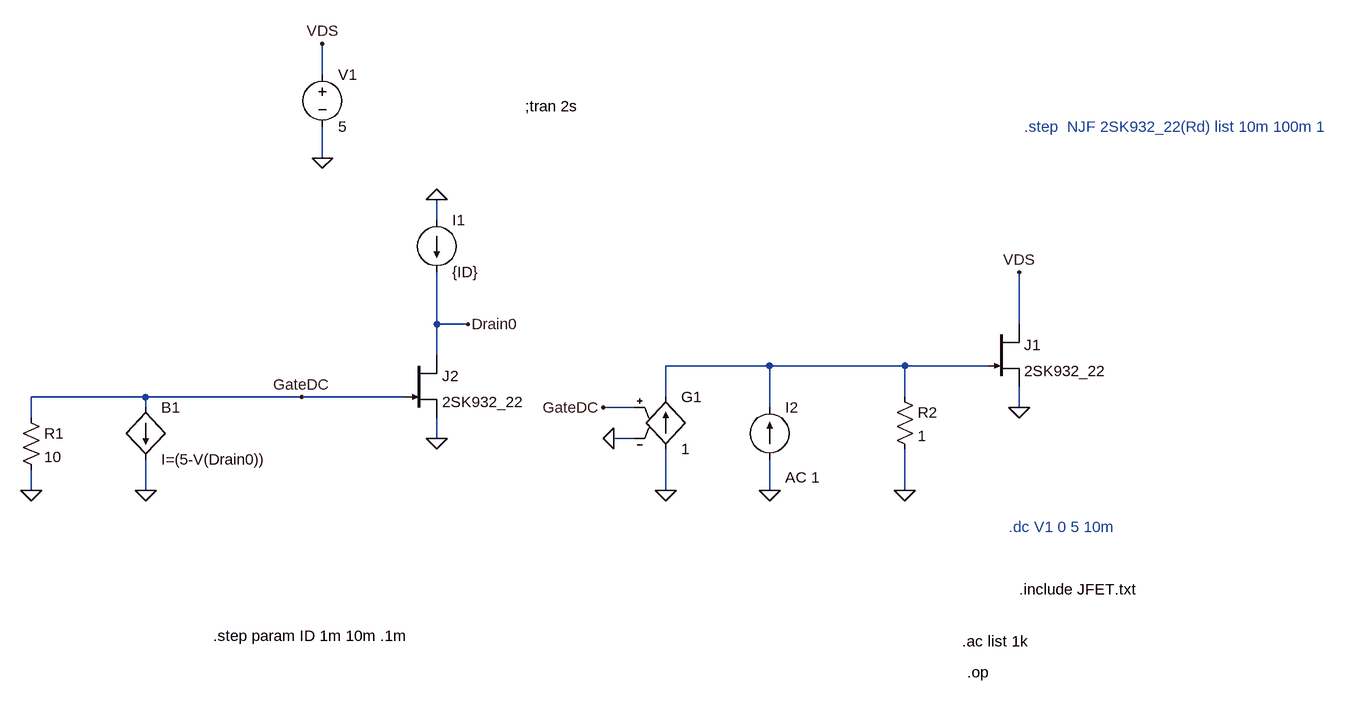
[diagram p0: schematic Yfs.asc]
Yfs.asc, the LTspice schematic file:
Version 4
SHEET 1 3232 872
WIRE -240 -176 -240 -224
WIRE -240 -48 -240 -96
WIRE -64 48 -64 16
WIRE -64 208 -64 128
WIRE -16 208 -64 208
WIRE 832 208 832 128
WIRE -64 256 -64 208
WIRE 448 272 288 272
WIRE 656 272 448 272
WIRE 784 272 656 272
WIRE -512 320 -688 320
WIRE -272 320 -512 320
WIRE -112 320 -272 320
WIRE 288 320 288 272
WIRE 656 320 656 272
WIRE -512 336 -512 320
WIRE 240 336 192 336
WIRE 448 336 448 272
WIRE 832 336 832 304
WIRE -688 352 -688 320
WIRE -64 384 -64 352
WIRE 240 384 208 384
WIRE -688 464 -688 432
WIRE -512 464 -512 416
WIRE 288 464 288 400
WIRE 448 464 448 416
WIRE 656 464 656 400
FLAG -240 -224 VDS
FLAG 832 128 VDS
FLAG -240 -48 0
FLAG 832 336 0
FLAG -64 384 0
FLAG -64 16 0
FLAG -16 208 Drain0
FLAG -512 464 0
FLAG -688 464 0
FLAG -272 320 GateDC
FLAG 656 464 0
FLAG 288 464 0
FLAG 208 384 0
FLAG 192 336 GateDC
FLAG 448 464 0
SYMBOL njf 784 208 R0
SYMATTR InstName J1
SYMATTR Value 2SK932_22
SYMBOL voltage -240 -192 R0
WINDOW 123 0 0 Left 0
WINDOW 39 0 0 Left 0
SYMATTR InstName V1
SYMATTR Value 5
SYMBOL njf -112 256 R0
SYMATTR InstName J2
SYMATTR Value 2SK932_22
SYMBOL current -64 48 R0
SYMATTR InstName I1
SYMATTR Value {ID}
SYMBOL bi -512 336 R0
SYMATTR InstName B1
SYMATTR Value I=(5-V(Drain0))
SYMBOL res -704 336 R0
SYMATTR InstName R1
SYMATTR Value 10
SYMBOL res 640 304 R0
SYMATTR InstName R2
SYMATTR Value 1
SYMBOL g 288 304 R0
SYMATTR InstName G1
SYMATTR Value 1
SYMBOL current 448 416 M180
WINDOW 0 24 80 Left 2
WINDOW 3 24 0 Left 2
WINDOW 123 24 -28 Left 2
WINDOW 39 0 0 Left 0
SYMATTR InstName I2
SYMATTR Value ""
SYMATTR Value2 AC 1
TEXT 72 -128 Left 2 !;tran 2s
TEXT 816 520 Left 2 ;.dc V1 0 5 10m
TEXT 832 616 Left 2 !.include JFET.txt
TEXT 840 -96 Left 2 ;.step  NJF 2SK932_22(Rd) list 10m 100m 1
TEXT 744 696 Left 2 !.ac list 1k
TEXT 752 744 Left 2 !.op
TEXT -408 688 Left 2 !.step param ID 1m 10m .1m

The netlist it stands for:
* Yfs.asc
J1 VDS N001 0 2SK932_22
V1 VDS 0 5
J2 Drain0 GateDC 0 2SK932_22
I1 0 Drain0 {ID}
B1 GateDC 0 I=(5-V(Drain0))
R1 GateDC 0 10
R2 N001 0 1
G1 0 N001 GateDC 0 1
I2 0 N001 AC 1
.model NJF NJF
.model PJF PJF
.lib standard.jft
;tran 2s
* .dc V1 0 5 10m
.include JFET.txt
* .step  NJF 2SK932_22(Rd) list 10m 100m 1
.ac list 1k
.op
.step param ID 1m 10m .1m
.backanno
.end